# EAGLE design rev2-roadrunner (EAGLE 8.2.2)
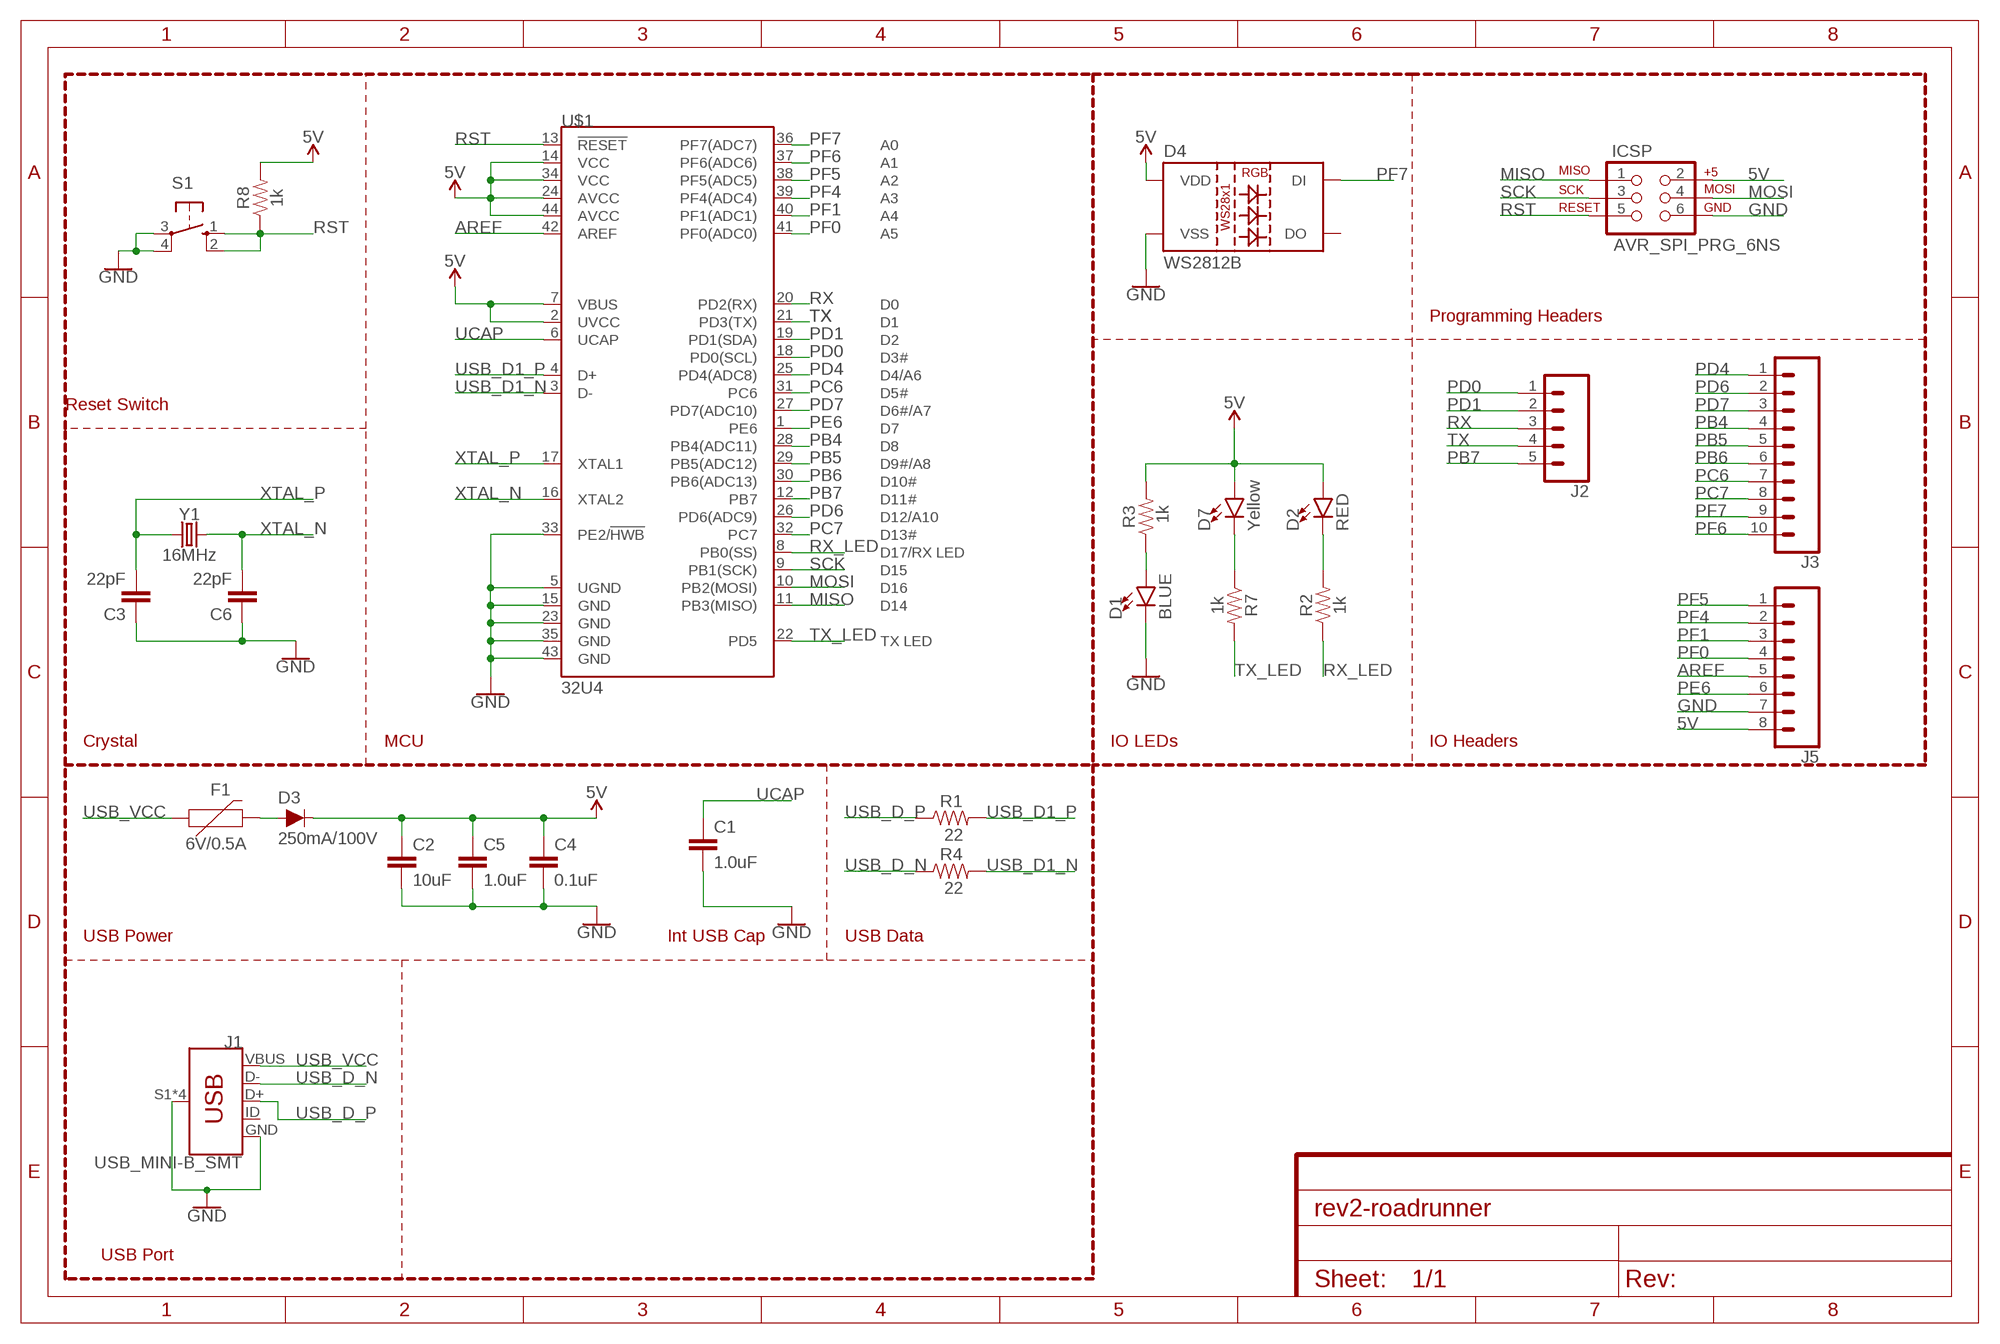
[diagram p0: schematic, sheet 1]

## Parts
C1  1.0uF  1.0UF-1206-50V-10%  [1206]
C2  10uF  10UF-1206-6.3V-20%  [1206]
C3  22pF  10UF-1206-6.3V-20%  [1206]
C4  0.1uF  1.0UF-1206-50V-10%  [1206]
C5  1.0uF  1.0UF-1206-50V-10%  [1206]
C6  22pF  10UF-1206-6.3V-20%  [1206]
D1  BLUE  LED-BLUE1206  [LED-1206]
D2  RED  LED-RED1206  [LED-1206]
D3  250mA/100V  DIODE-BAS16J  [SOD-323]
D4  WS2812B  [WS2812B]
D7  Yellow  LED-YELLOWLILYPAD  [LED-1206]
F1  6V/0.5A  PPTC_HALF-AMP  [1206]
ICSP  AVR_SPI_PRG_6NS  [2X3-NS]
J1  USB_MINI-B_SMT  [USB-MINIB]
J2  CONN_05  [1X05]
J3  CONN_10"  [1X10]
J5  CONN_08"  [1X08]
R1  22  RESISTOR1206  [1206]
R2  1k  RESISTOR1206  [1206]
R3  1k  RESISTOR1206  [1206]
R4  22  RESISTOR1206  [1206]
R7  1k  RESISTOR1206  [1206]
R8  1k  RESISTOR1206  [1206]
S1  10-XX  [B3F-10XX]
U$1  32U4  ATMEGA32U4TQFP-44  [TQFP44]
Y1  16MHz  CRYSTAL-16MHZPTH-HC49US  [HC49US]

## Nets
5V [VCC]: C2.1 C4.1 C5.1 D2.A D3.C D4.1(VDD) D7.A ICSP.2 J5.8 R3.2 R8.2 U$1.2(UVCC) U$1.7(VBUS) U$1.14(VCC) U$1.24(AVCC) U$1.34(VCC) U$1.44(AVCC)
AREF: J5.5 U$1.42(AREF)
GND [GND]: C1.2 C2.2 C3.1 C4.2 C5.2 C6.1 D1.C D4.3(VSS) ICSP.6 J1.GND J1.S1(SHIELD) J1.S2(SHIELD) J1.S3(SHIELD) J1.S4(SHIELD) J5.7 S1.3(P) S1.4(P1) U$1.5(UGND) U$1.15(GND) U$1.23(GND) U$1.33(PE2/!HWB) U$1.35(GND) U$1.43(GND)
MISO: ICSP.1 U$1.11(PB3(MISO))
MOSI: ICSP.4 U$1.10(PB2(MOSI))
N$1: D1.A R3.1
N$2: D7.C R7.1
N$3: D2.C R2.2
N$4: D3.A F1.2
PB4: J3.4 U$1.28(PB4(ADC11))
PB5: J3.5 U$1.29(PB5(ADC12))
PB6: J3.6 U$1.30(PB6(ADC13))
PB7: J2.5 U$1.12(PB7)
PC6: J3.7 U$1.31(PC6)
PC7: J3.8 U$1.32(PC7)
PD0: J2.1 U$1.18(PD0(SCL))
PD1: J2.2 U$1.19(PD1(SDA))
PD4: J3.1 U$1.25(PD4(ADC8))
PD6: J3.2 U$1.26(PD6(ADC9))
PD7: J3.3 U$1.27(PD7(ADC10))
PE6: J5.6 U$1.1(PE6)
PF0: J5.4 U$1.41(PF0(ADC0))
PF1: J5.3 U$1.40(PF1(ADC1))
PF4: J5.2 U$1.39(PF4(ADC4))
PF5: J5.1 U$1.38(PF5(ADC5))
PF6: J3.10 U$1.37(PF6(ADC6))
PF7: D4.4(DI) J3.9 U$1.36(PF7(ADC7))
RST: ICSP.5 R8.1 S1.1(S) S1.2(S1) U$1.13(!RESET)
RX: J2.3 U$1.20(PD2(RX))
RX_LED: R2.1 U$1.8(PB0(SS))
SCK: ICSP.3 U$1.9(PB1(SCK))
TX: J2.4 U$1.21(PD3(TX))
TX_LED: R7.2 U$1.22(PD5)
UCAP: C1.1 U$1.6(UCAP)
USB_D1_N: R4.2 U$1.3(D-)
USB_D1_P: R1.2 U$1.4(D+)
USB_D_N: J1.D- R4.1
USB_D_P: J1.D+ R1.1
USB_VCC [VCC]: F1.1 J1.VBUS
XTAL_N: C6.2 U$1.16(XTAL2) Y1.2
XTAL_P: C3.2 U$1.17(XTAL1) Y1.1
Unconnected: D4.2(DO) J1.ID

## Notes on the sheet
- Programming Headers
- Reset Switch
- Crystal | MCU | IO LEDs | IO Headers
- USB Power | Int USB Cap | USB Data
- USB Port

## Library data of the parts
C1 C5 = SparkFun-Capacitors:1.0UF: 1µF ceramic capacitors A capacitor is a passive two-terminal electrical component used to store electrical energy temporarily in an electric field.; PROD_ID: CAP-09822
C2 = SparkFun-Capacitors:10UF: 10.0µF ceramic capacitors A capacitor is a passive two-terminal electrical component used to store electrical energy temporarily in an electric field.; PROD_ID: CAP-10057
C3 C6 = SparkFun-Capacitors:10UF: 10.0µF ceramic capacitors A capacitor is a passive two-terminal electrical component used to store electrical energy temporarily in an electric field.; PROD_ID: CAP-10057; VALUE: 10uF
C4 = SparkFun-Capacitors:1.0UF: 1µF ceramic capacitors A capacitor is a passive two-terminal electrical component used to store electrical energy temporarily in an electric field.; PROD_ID: CAP-09822; VALUE: 1.0uF
D1 = SparkFun-LED:LED-BLUE: Blue SMD LED Used in manufacturing of various products at SparkFun Packages: 0603 - SMD 0603 package [Product Link] <http://www.digikey.com/product-detail/en/SMLE12BC7TT86/511-1589-2-ND/1641808> 1206 - SMD1206 package [Product Link] <http://www.digikey.com/product-detail/en/lite-on-inc/LTST-C150TBKT/160-1643-1-ND/573584> SparkFun Products: ESP8266 Thing-Dev Board <https://www.sparkfun.com/products/13711> RedBoard <https://www.sparkfun.com/products/12757>; PROD_ID: DIO-09911
D2 = SparkFun-LED:LED-RED: Red SMD LED Used in manufacturing of most products at SparkFun Packages: 0603 - SMD 0603 package [Product Link] <http://docs.avagotech.com/docs/AV02-0551EN> 0603 SMART - SMD 0603 SMART package ( more efficient and expensive)[Product Link] <http://www.osram-os.com/Graphics/XPic2/00077099_0.pdf> 1206 - SMD1206 package [Product Link] <https://www.sparkfun.com/datasheets/DevTools/LilyPad/Q150OVS4.pdff> SparkFun Products: Pro Mini 328 -5V <https://www.sparkfun.com/products/821> RedBoard <https://www.sparkfun.com/products/12757> IOIO-OTG <https://www.sparkfun.com/products/13613>; PROD_ID: DIO-09912
D3 = SparkFun-DiscreteSemi:DIODE: Diode These are standard reverse protection diodes and small signal diodes. SparkFun Products: SparkFun SparkPunk Sound Kit <https://www.sparkfun.com/products/11177> SparkFun ESP8266 Thing <https://www.sparkfun.com/products/13231>; PROD_ID: DIO-09646
D4 = SparkFun-LED:WS2812B: WS2812B SMD addressable RGB LED 5x5mm SMD LED with built-in controller IC. Color: Red/Green/Blue mC Rating: RGB: 390, 660, 180 mcd Forward Voltage: RGB: 2.0, 3.0, 3.0 V Packages:WS2812B SparkFun Products: Blynk Board - ESP8266 <https://www.sparkfun.com/products/13794>; PROD_ID: DIO-12503
D7 = SparkFun-LED:LED-YELLOW: Yellow SMD LED Used in manufacturing several products at SparkFun. Packages: 0603 - SMD 0603 package[Product Link] <http://www.kingbrightusa.com/product.asp?catalog_name=LED&product_id=APT1608SYCK> 0603 -SMART - SMART SMD 0603 package (more efficient/more expensive) [Product Link] <http://www.osram-os.com/osram_os/en/products/product-catalog/led-light-emitting-diodes/smartled-0603/ly-l29k/index.jsp> LilyPad - SMD1206 package[Product Datasheet] <https://www.sparkfun.com/datasheets/DevTools/LilyPad/Q150YUS4.pdf> SparkFun Products: Blynk Board <https://www.sparkfun.com/products/13794> IOIO-OTG <https://www.sparkfun.com/products/13613> XBee Explorer Serial <https://www.sparkfun.com/products/13225>; PROD_ID: DIO-09909
F1 = SparkFun-Fuses:PPTC: Resettable Fuse PPTC Resettable Fuse. Really a sort of resistor with a polymeric positive temperature coefficient whose resistance increases dramatically with an increase in temperature. When heated by the power passing through the resistance rises causing the current to be limited, protecting the circuit. This is achieved by the transition of the polymer from a crystalline to an amorphous state where the conductive carbon separates breaking the conductive pathways found in the cool crystalline structure. When a PPTC cools back down it resumes conducting letting the circuit turn back on. SparkFun Products: SparkFun RedBoard - Programmed with Arduino <https://www.sparkfun.com/products/12757> Pro Micro - 5V/16MHz <https://www.sparkfun.com/products/12640> Arduino Pro 328 - 5V/16MHz <https://www.sparkfun.com/products/10915> MP3 Trigger <https://www.sparkfun.com/products/13720>; PROD_ID: RES-08585
ICSP = SparkFun-Connectors:AVR_SPI_PRG_6: AVR ISP 6 Pin This is the reduced ISP connector for AVR programming. Common on Arduino. This footprint will take up less PCB space and can be used with a 10-pin to 6-pin adapter such as SKU: BOB-08508 **Special note about "TEST_POINT" package. The stop mask is on the top side, so if you want your programming test points to be on the bottom of your board, make sure to place this package on the bottom side of the board. This also ensure that the orientation to program from the bottom side will be correct.
J1 = SparkFun-Connectors:USB_MINI-B: USB type Mini-B Connector Breaks out 5th pin, and includes shield pins if needed. SparkFun Products: SparkFun FTDI Basic Breakout <https://www.sparkfun.com/products/9716> SparkFun XBee Explorer USB <https://www.sparkfun.com/products/11812> SparkFun Redboard <https://www.sparkfun.com/products/12757>; PROD_ID: CONN-08193; SF_ID: PRT-00587
J2 = SparkFun-Connectors:CONN_05: Multi connection point. Often used as Generic Header-pin footprint for 0.1 inch spaced/style header connections On any of the 0.1 inch spaced packages, you can populate with these: Break Away Headers - Straight <https://www.sparkfun.com/products/116> (PRT-00116) Break Away Male Headers - Right Angle <https://www.sparkfun.com/products/553> (PRT-00553) Female Headers <https://www.sparkfun.com/products/115> (PRT-00115) Break Away Headers - Machine Pin <https://www.sparkfun.com/products/117> (PRT-00117) Break Away Female Headers - Swiss Machine Pin <https://www.sparkfun.com/products/743> (PRT-00743) For SCREWTERMINALS and SPRING TERMINALS visit here: Screw Terimnals on SparkFun.com <https://www.sparkfun.com/search/results?term=Screw+Terminals> (5mm/3.5mm/2.54mm spacing) This device is also useful as a general connection point to wire up your design to another part of your project. Our various solder wires solder well into these plated through hole pads. Hook-Up Wire - Assortment (Stranded, 22 AWG) <https://www.sparkfun.com/products/11375> (PRT-11375) Hook-Up Wire - Assortment (Solid Core, 22 AWG) <https://www.sparkfun.com/products/11367> (PRT-11367) View the entire wire category on our website here <https://www.sparkfun.com/categories/141> Special notes: Molex polarized connector foot print use with SKU : PRT-08231 with associated crimp pins and housings. 1MM SMD Version SKU: PRT-10208
J3 = SparkFun-Connectors:CONN_10: Multi connection point. Often used as Generic Header-pin footprint for 0.1 inch spaced/style header connections On any of the 0.1 inch spaced packages, you can populate with these: Break Away Headers - Straight <https://www.sparkfun.com/products/116> (PRT-00116) Break Away Male Headers - Right Angle <https://www.sparkfun.com/products/553> (PRT-00553) Female Headers <https://www.sparkfun.com/products/115> (PRT-00115) Break Away Headers - Machine Pin <https://www.sparkfun.com/products/117> (PRT-00117) Break Away Female Headers - Swiss Machine Pin <https://www.sparkfun.com/products/743> (PRT-00743) Arduino Stackable Header - 10 Pin <https://www.sparkfun.com/products/11376> (PRT-11376) For SCREWTERMINALS and SPRING TERMINALS visit here: Screw Terimnals on SparkFun.com <https://www.sparkfun.com/search/results?term=Screw+Terminals> (5mm/3.5mm/2.54mm spacing) This device is also useful as a general connection point to wire up your design to another part of your project. Our various solder wires solder well into these plated through hole pads. Hook-Up Wire - Assortment (Stranded, 22 AWG) <https://www.sparkfun.com/products/11375> (PRT-11375) Hook-Up Wire - Assortment (Solid Core, 22 AWG) <https://www.sparkfun.com/products/11367> (PRT-11367) View the entire wire category on our website here <https://www.sparkfun.com/categories/141> Special notes: Molex polarized connector foot print use with SKU : PRT-08231 with associated crimp pins and housings. 1MM SMD Version SKU: PRT-10208 NOTES ON THE VARIANTS LOCK and LOCK_LONGPADS... This footprint was designed to help hold the alignment of a through-hole component (i.e. 6-pin header) while soldering it into place. You may notice that each hole has been shifted either up or down by 0.005 of an inch from it's more standard position (which is a perfectly straight line). This slight alteration caused the pins (the squares in the middle) to touch the edges of the holes. Because they are alternating, it causes a "brace" to hold the component in place. 0.005 has proven to be the perfect amount of "off-center" position when using our standard breakaway headers. Although looks a little odd when you look at the bare footprint, once you have a header in there, the alteration is very hard to notice. Also,if you push a header all the way into place, it is covered up entirely on the bottom side.; PROD_ID: CONN-11563
J5 = SparkFun-Connectors:CONN_08: Multi connection point. Often used as Generic Header-pin footprint for 0.1 inch spaced/style header connections On any of the 0.1 inch spaced packages, you can populate with these: Break Away Headers - Straight <https://www.sparkfun.com/products/116> (PRT-00116) Break Away Male Headers - Right Angle <https://www.sparkfun.com/products/553> (PRT-00553) Female Headers <https://www.sparkfun.com/products/115> (PRT-00115) Break Away Headers - Machine Pin <https://www.sparkfun.com/products/117> (PRT-00117) Break Away Female Headers - Swiss Machine Pin <https://www.sparkfun.com/products/743> (PRT-00743) Arduino Stackable Header - 8 Pin <https://www.sparkfun.com/products/9279> (PRT-09279) For SCREWTERMINALS and SPRING TERMINALS visit here: Screw Terimnals on SparkFun.com <https://www.sparkfun.com/search/results?term=Screw+Terminals> (5mm/3.5mm/2.54mm spacing) This device is also useful as a general connection point to wire up your design to another part of your project. Our various solder wires solder well into these plated through hole pads. Hook-Up Wire - Assortment (Stranded, 22 AWG) <https://www.sparkfun.com/products/11375> (PRT-11375) Hook-Up Wire - Assortment (Solid Core, 22 AWG) <https://www.sparkfun.com/products/11367> (PRT-11367) View the entire wire category on our website here <https://www.sparkfun.com/categories/141> Special notes: Molex polarized connector foot print use with SKU : PRT-08231 with associated crimp pins and housings. 1MM SMD Version SKU: PRT-10208 NOTES ON THE VARIANTS LOCK and LOCK_LONGPADS... This footprint was designed to help hold the alignment of a through-hole component (i.e. 6-pin header) while soldering it into place. You may notice that each hole has been shifted either up or down by 0.005 of an inch from it's more standard position (which is a perfectly straight line). This slight alteration caused the pins (the squares in the middle) to touch the edges of the holes. Because they are alternating, it causes a "brace" to hold the component in place. 0.005 has proven to be the perfect amount of "off-center" position when using our standard breakaway headers. Although looks a little odd when you look at the bare footprint, once you have a header in there, the alteration is very hard to notice. Also,if you push a header all the way into place, it is covered up entirely on the bottom side.; PROD_ID: CONN-08438
R1-R4 R7 R8 = SparkFun-Resistors:RESISTOR: Generic Resistor Package
S1 = switch-omron:10-XX: OMRON SWITCH; MPN: B3F-1000; OC_FARNELL: 176432; OC_NEWARK: 36M3542
U$1 = SparkFun-IC-Microcontroller:ATMEGA32U4: Atmel MCU, 32KByte Atmel 44-pin 8-bit Microcontroller with 32KBytes of ISP Flash and USB Controller Datasheet <http://cdn.sparkfun.com/datasheets/Dev/Arduino/Boards/ATMega32U4.pdf> SparkFun Products LilyPad Arduino USB - ATmega32U4 Board <https://www.sparkfun.com/products/12049> (DEV-12049) Pro Micro - 5V/16MHz <https://www.sparkfun.com/products/12640> (DEV-12640) Pro Micro - 3.3V/8MHz <https://www.sparkfun.com/products/12587> (DEV-12587) Fio v3 - ATmega32U4 <https://www.sparkfun.com/products/11520> (DEV-11520) Qduino Mini <https://www.sparkfun.com/products/13614> (DEV-13614) Makey Makey - Standard Kit <https://www.sparkfun.com/products/11511> (WIG-11511) Makey Makey Deluxe Kit <https://www.sparkfun.com/products/11519> (WIG-11519); PROD_ID: IC-11161
Y1 = SparkFun-Clocks:CRYSTAL-16MHZ: 16MHz Crystal Digikey Example <http://www.digikey.com/product-search/en?keywords=535-9122-1-ND> Frequency: 16MHz Frequency Stability: ±50ppm Frequency Tolerance: ±20ppm Load Capacitance: 18pF SparkFun Products: Pro Micro -5V/16MHz <https://www.sparkfun.com/products/12640> SparkFun Serial Enabled LCD Kit <https://www.sparkfun.com/products/10097>; PROD_ID: XTAL-08181; SF_ID: COM-00536

## Net classes
1 GND: width 0.254 mm
2 VBAT: width 0.254 mm
3 VCC: width 0.254 mm

## Board
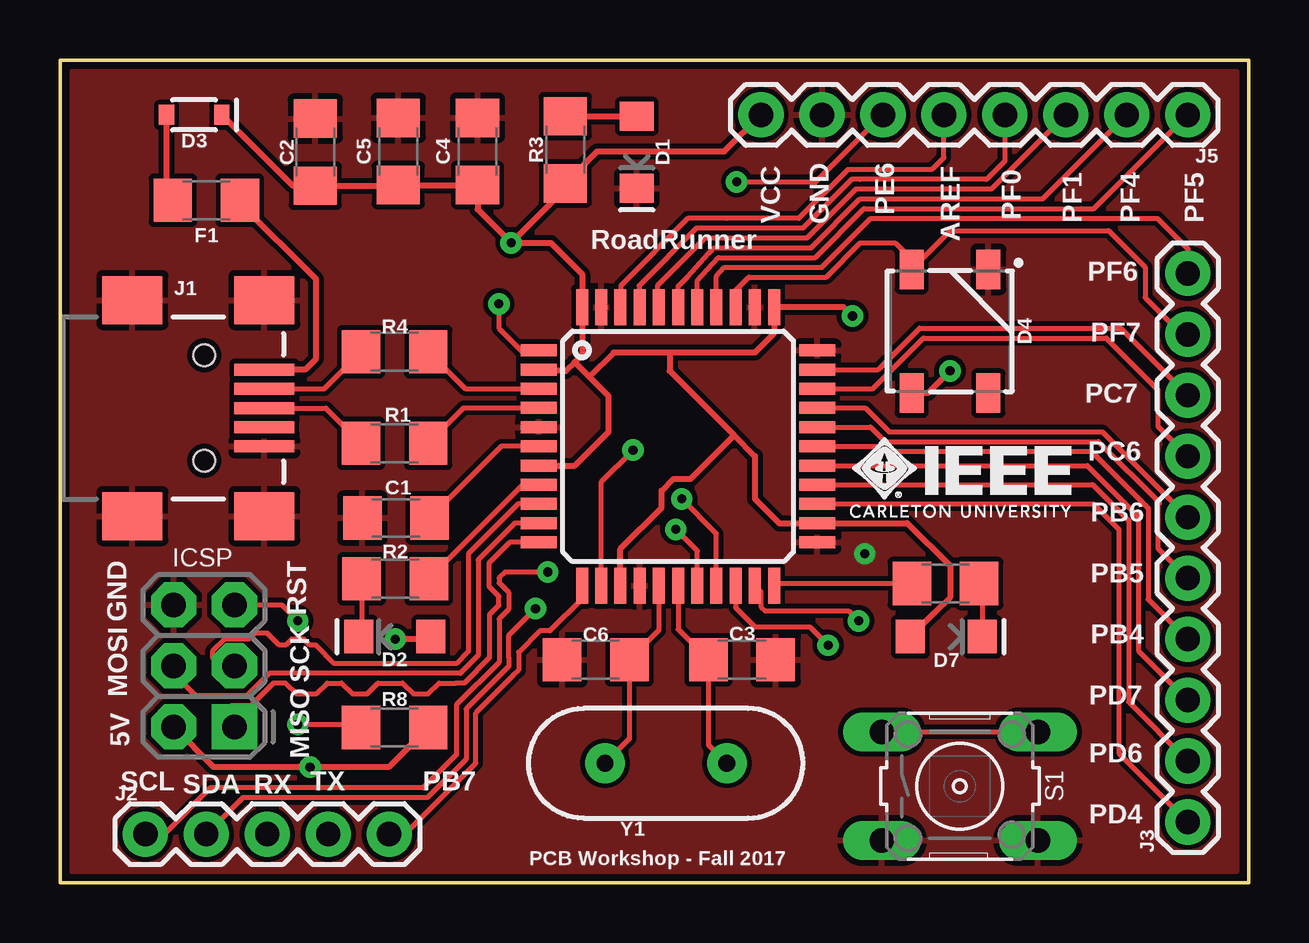
[diagram p1: board, top side]
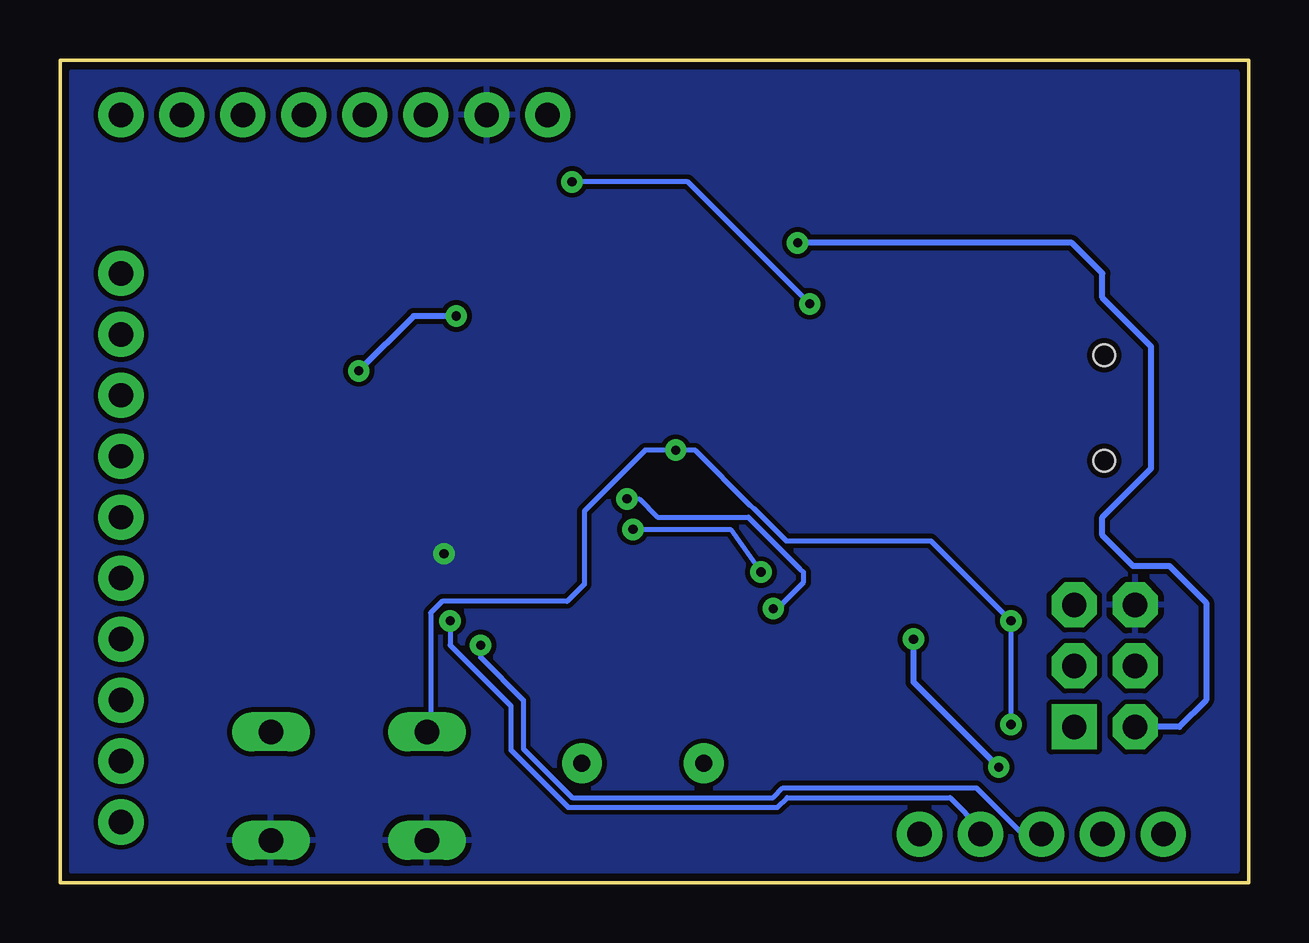
[diagram p2: board, bottom side, seen from below]

Size 49.53 x 34.29 mm. Coordinates in mm from the lower left corner, seen from the top.
Outline: 0,0 0,34.29 49.53,34.29 49.53,0 0,0
Copper layers (1*16): Top 0.035mm / dielectric 1.5mm / Bottom 0.035mm
Design rules "SparkFun *": minimum track width 8mil, minimum drill 15mil, track to track 8mil, track to pad 8mil, pad to pad 8mil, via to via 8mil, smd to smd 8mil, copper to edge 10mil, drill to drill 8mil, minimum pad ring 12mil, minimum via ring 10mil, stop-mask expansion 4mil, vias tented up to drill 25mil, thermal gap 10mil

### Footprints (pad centres in the part's own frame; a part is rotated, then mirrored left to right if it is on the bottom)
1206 = smd 1.6 x 1.8: 1 -1.4,0; 2 1.4,0
LED-1206 = smd 1.2 x 1.4: A -1.5,0; C 1.5,0
SOD-323 = smd 0.63 x 0.83: A 1.15,0; C -1.15,0
WS2812B = smd 1.651 x 1: 1 2.577,-1.6; 2 2.577,1.6; 3 -2.577,1.6; 4 -2.577,-1.6
2X3-NS = drill 1.016 pad 1.88 square: 1 -2.54,-1.27 | drill 1.016 pad 1.88 octagon: 2 -2.54,1.27; 3 0,-1.27; 4 0,1.27; 5 2.54,-1.27; 6 2.54,1.27
USB-MINIB = smd 2.5 x 0.5: D+ 2.5,0; D- 2.5,0.8; GND 2.5,-1.6; ID 2.5,-0.8; VBUS 2.5,1.6 | smd 2.5 x 2: S1 -3,4.5; S2 2.5,4.5; S3 -3,-4.5; S4 2.5,-4.5 | hole 0.9: 0,2.2; 0,-2.2
1X05 = drill 1.016 pad 1.88: 1 0,0; 2 2.54,0; 3 5.08,0; 4 7.62,0; 5 10.16,0
1X10 = drill 1.016 pad 1.88: 1 0,0; 2 2.54,0; 3 5.08,0; 4 7.62,0; 5 10.16,0; 6 12.7,0; 7 15.24,0; 8 17.78,0; 9 20.32,0; 10 22.86,0
1X08 = drill 1.016 pad 1.88: 1 0,0; 2 2.54,0; 3 5.08,0; 4 7.62,0; 5 10.16,0; 6 12.7,0; 7 15.24,0; 8 17.78,0
B3F-10XX = drill 1.016 long: 1 -3.251,2.261; 2 3.251,2.261; 3 -3.251,-2.261; 4 3.251,-2.261
TQFP44 = smd 1.5 x 0.5: 1 -5.8,4; 2 -5.8,3.2; 3 -5.8,2.4; 4 -5.8,1.6; 5 -5.8,0.8; 6 -5.8,0; 7 -5.8,-0.8; 8 -5.8,-1.6; 9 -5.8,-2.4; 10 -5.8,-3.2; 11 -5.8,-4; 23 5.8,-4; 24 5.8,-3.2; 25 5.8,-2.4; 26 5.8,-1.6; 27 5.8,-0.8; 28 5.8,0; 29 5.8,0.8; 30 5.8,1.6; 31 5.8,2.4; 32 5.8,3.2; 33 5.8,4 | smd 0.5 x 1.5: 12 -4,-5.8; 13 -3.2,-5.8; 14 -2.4,-5.8; 15 -1.6,-5.8; 16 -0.8,-5.8; 17 0,-5.8; 18 0.8,-5.8; 19 1.6,-5.8; 20 2.4,-5.8; 21 3.2,-5.8; 22 4,-5.8; 34 4,5.8; 35 3.2,5.8; 36 2.4,5.8; 37 1.6,5.8; 38 0.8,5.8; 39 0,5.8; 40 -0.8,5.8; 41 -1.6,5.8; 42 -2.4,5.8; 43 -3.2,5.8; 44 -4,5.8
HC49US = drill 0.7 pad 1.651: 1 -2.54,0; 2 2.54,0

### Placement (x,y rotation side)
C1  14,15.21 180 top
C2  10.64,30.45 90 top
C3  28.42,9.3 180 top
C4  17.4,30.48 90 top
C5  14.1,30.48 90 top
C6  22.32,9.3 0 top
D1  24.03,30.45 270 top
D2  13.94,10.26 180 top
D3  5.59,32 180 top
D4  37.08,22.99 270 top
D7  36.93,10.26 0 top
F1  6.1,28.45 180 top
ICSP  6,9.04 90 top
J1  6.01,19.79 0 top
J2  3.56,2.03 0 top
J3  46.99,2.54 90 top
J5  46.99,32 180 top
R1  13.94,18.32 0 top
R2  13.97,12.67 180 top
R3  21.05,30.55 270 top
R4  13.94,22.13 0 top
R7  36.9,12.48 180 top
R8  13.94,6.48 0 top
S1  37.49,4.03 0 top
U$1  25.75,18.19 0 top
U$2  [IEEECARLETON-ROADRUNNER]  32.87,15.14 0 top
Y1  25.25,4.99 180 top

### Tracks (layer width: path | path; a pad name or v marks a point on that pad's centre or on a via)
5V  (via drill 0.38)
  Top 0.254: D3.C 9.69,29.05 C2.1 14.07,29.05 | 21.45,21.7 21.75,22.01 U$1.44 21.75,25.37 20.46,26.67 v18.8,26.67 | 21.45,21.7 21.08,21.34 20.01,21.34 U$1.2 | U$1.7 21.46,17.39 22.86,18.8 22.86,20.29 22.06,21.09 | 22.06,21.09 21.45,21.7 | 22.06,21.09 23.06,22.1 25.4,22.1 | v33.02,23.62 32.65,23.99 U$1.34 29.75,22.89 28.96,22.1 25.4,22.1 | v37.08,21.34 36.16,20.41 D4.1 | 20.98,29.08 R3.2 | J5.8 27.69,30.48 22.38,30.48 R3.2 | 25.4,22.1 25.4,21.34 28.09,18.65 | 28.09,18.65 28.96,17.78 28.96,16 29.97,14.99 U$1.24 35.3,14.99 37.08,13.21 37.08,11.9 36.43,11.25 36.42,11.25 D7.A | U$1.14 23.35,13.92 25.07,15.63 25.07,16.35 25.56,16.84 26.28,16.84 28.09,18.65 | D2.A 15.34,10.16 v13.97,10.16 | R8.2 13.69,4.83 v10.41,4.83 6.41,4.83 ICSP.2 | v18.8,26.67 21.05,28.92 R3.2 | v18.8,26.67 17.4,28.07 C4.1 C5.1
  Top 0.406: 14.07,29.05 C5.1
  Bottom 0.254: v33.02,23.62 34.8,23.62 v37.08,21.34 | v18.8,26.67 7.37,26.67 6.1,25.4 6.1,24.38 4.06,22.35 4.06,17.27 6.1,15.24 6.1,14.48 4.83,13.21 3.3,13.21 1.78,11.68 1.78,7.62 2.89,6.5 ICSP.2 | v13.97,10.16 13.97,8.38 v10.41,4.83
AREF
  Top 0.203: J5.5 36.83,30.23 36.32,29.72 33.49,29.72 | 33.49,29.72 | 33.49,29.72 32.82,29.72 30.79,27.69 27.77,27.69 | 27.77,27.69 | 27.77,27.69 26.16,27.69 23.37,24.89 23.37,24.01 U$1.42
GND  (via drill 0.38)
  other vias: 33.53,13.72
  pour Top: 0.51,33.78 0.51,0.51 49.02,0.51 49.02,33.78
  pour Bottom: 0.51,33.78 0.51,0.51 49.02,0.51 49.02,33.78
MISO
  Top 0.203: U$1.11 18.73,14.19 17.89,13.35 17.89,12.34 18.29,11.94 18.29,11.57 17.89,11.18 17.89,9.37 16.85,8.33 16.51,8.33 | 16.51,8.33 | 16.51,8.33 15.79,8.33 15.33,7.87 14.73,7.87 14.28,8.33 13.25,8.33 12.79,7.87 12.19,7.87 11.73,8.33 11.12,8.33 10.67,7.87 9.86,7.87 9.4,8.33 8.89,8.33 7.96,7.39 7.14,7.39 6.6,6.86 6.6,6.6 6.86,6.35 7.12,6.35 ICSP.1
MOSI
  Top 0.203: U$1.10 18.96,14.99 17.42,13.46 17.42,9.48 16.68,8.74 8.72,8.74 7.79,7.8 5.66,7.8 5.08,8.38 5.08,8.7 ICSP.4
N$1
  Top 0.254: R3.1 D1.A | D1.A
N$2
  Top 0.203: R7.1 38.43,12.35 D7.C
N$3
  Top 0.203: R2.2 12.57,10.39 D2.C
N$4
  Top 0.254: 4.44,28.71 D3.A
  Top 0.406: F1.2 4.44,28.71
PB4
  Top 0.203: U$1.28 34,18.19 34.21,17.98 42.98,17.98 45.34,15.62 45.34,11.81 J3.4
PB5
  Top 0.203: U$1.29 33.77,18.99 34.38,18.39 43.27,18.39 45.82,15.83 45.74,15.76 45.74,13.95 J3.5
PB6
  Top 0.203: U$1.30 33.55,19.79 34.54,18.8 43.43,18.8 J3.6
PB7
  Top 0.203: U$1.12 21.75,11.85 20.41,10.51 20,10.51 19.11,9.62 19.11,8.87 18.87,8.63 | 18.87,8.63 | 18.87,8.63 17.32,7.08 17.32,5 14.36,2.03 J2.5
PC6
  Top 0.203: U$1.31 33.87,20.59 35.97,22.7 43.59,22.7 45.74,20.55 45.74,19.02 J3.7
PC7
  Top 0.203: U$1.32 34.09,21.39 35.81,23.11 44.2,23.11 J3.8
PD0  (via drill 0.38)
  Top 0.203: U$1.18 26.55,13.83 v25.65,14.73 | v20.32,12.95 18.54,12.95 18.3,12.71 18.3,12.51 18.69,12.11 18.69,11.41 18.3,11.01 18.3,9.21 16.51,7.42 16.51,5.33 15.14,3.96 6.27,3.96 4.34,2.03 J2.1
  Bottom 0.203: v25.65,14.73 21.59,14.73 v20.32,12.95
PD1  (via drill 0.38)
  Top 0.203: U$1.19 27.35,14.56 v25.91,16 | 18.7,9.37 | 18.7,9.37 18.7,9.04 16.92,7.25 16.92,5.16 15.31,3.56 7.62,3.56 J2.2 | v19.81,11.43 18.7,10.32 18.7,9.37
  Bottom 0.203: v25.91,16 25.4,16 24.64,15.24 20.85,15.24 18.7,13.09 18.54,12.95 18.54,12.53 19.65,11.43 v19.81,11.43
PD4
  Top 0.203: U$1.25 43.06,15.79 44.12,14.73 44.12,5.41 J3.1
PD6
  Top 0.203: U$1.26 43.03,16.59 44.53,15.1 44.53,7.54 J3.2
PD7
  Top 0.203: U$1.27 42.8,17.39 44.93,15.27 44.93,9.68 J3.3
PE6  (via drill 0.38)
  Top 0.203: v18.29,24.13 18.29,23.11 19.3,22.1 19.86,22.1 U$1.1 | v28.19,29.21 31.5,29.21 J5.6
  Bottom 0.203: v18.29,24.13 23.37,29.21 v28.19,29.21
PF0
  Top 0.203: J5.4 39.37,30.07 38.61,29.31 33.33,29.31 | 33.33,29.31 | 33.33,29.31 32.99,29.31 32,28.32 | 32,28.32 | 32,28.32 30.96,27.28 27.6,27.28 | 27.6,27.28 | 27.6,27.28 26.52,27.28 24.13,24.89 24.13,24.02 U$1.41
PF1
  Top 0.203: J5.3 38.81,28.91 33.16,28.91 | 24.89,24.05 U$1.40 24.89,24.05 | 32.41,28.15 33.16,28.91 | 32.41,28.15 31.12,26.87 27.43,26.87 | 33.16,28.91 32.41,28.15 | 27.43,26.87 | 27.43,26.87 26.87,26.87 24.89,24.89 24.89,24.05
PF4
  Top 0.203: 25.65,24.09 U$1.39 25.75,24.86 26.03,25.13 | J5.2 40.95,28.5 33.33,28.5 31.29,26.47 27.26,26.47 27.26,26.46 27.24,26.46 27.14,26.34 27.02,26.23 26.15,25.26 26.03,25.13 | 26.03,25.13 26,25.1
PF5
  Top 0.203: U$1.38 26.55,25.09 27.43,26.06 31.46,26.06 33.49,28.09 42.55,28.09 | 42.55,28.09 | J5.1 43.08,28.09 42.55,28.09
PF6
  Top 0.203: U$1.37 27.35,25.29 27.69,25.65 31.75,25.65 33.78,27.69 42.72,27.69 | 42.72,27.69 | 42.72,27.69 45.72,27.69 46.99,26.42 J3.10
PF7
  Top 0.203: U$1.36 28.15,24.7 28.7,25.25 31.92,25.25 33.34,26.67 34.8,26.67 35.48,25.98 D4.4 37.1,27.18 43.69,27.18 45.21,25.65 45.21,24.38 46.74,22.86 J3.9
RST  (via drill 0.38)
  Top 0.203: ICSP.5 9.24,11.59 v9.91,10.92 | v9.91,6.6 12.42,6.6 R8.1 | S1.1 S1.2 | v23.88,18.03 22.55,16.71 U$1.13
  Bottom 0.203: v9.91,6.6 v9.91,10.92 13.24,14.26 19.27,14.26 20.62,15.61 20.78,15.75 23.07,18.03 v23.88,18.03 25.15,18.03 27.69,15.49 27.69,12.45 28.4,11.73 33.61,11.73 34.09,11.26 34.09,6.45 S1.1
RX  (via drill 0.38)
  Top 0.203: U$1.20 28.15,11.47 28.96,10.67 31.24,10.67 v32,9.91
  Bottom 0.203: v32,9.91 32,9.4 30.23,7.62 30.23,5.59 28.19,3.56 19.81,3.56 19.41,3.96 11.35,3.96 9.42,2.03 J2.3
RX_LED
  Top 0.203: R2.1 19.29,16.59 U$1.8
SCK
  Top 0.203: U$1.9 19.1,15.79 17.02,13.72 17.02,9.65 16.51,9.14 11.43,9.14 10.67,9.91 10.41,9.91 10.16,10.16 9.65,10.16 9.4,9.91 9.14,9.91 8.64,10.41 8.13,10.41 7.87,10.16 6.86,10.16 6.35,9.65 6.35,9.4 6.7,9.04 ICSP.3
TX  (via drill 0.38)
  Top 0.203: U$1.21 29.2,12.15 29.2,11.52 29.38,11.34 32.86,11.34 v33.27,10.92
  Bottom 0.203: v33.27,10.92 33.27,9.91 30.73,7.37 30.73,5.52 28.36,3.15 19.64,3.15 19.24,3.56 12.45,3.56 11.18,2.29 J2.4
TX_LED
  Top 0.203: U$1.22 29.84,12.48 R7.2
UCAP
  Top 0.203: U$1.6 18.38,18.19 C1.1
USB_D1_N
  Top 0.203: R4.2 16.88,20.59 U$1.3
USB_D1_P
  Top 0.203: R1.2 16.82,19.79 U$1.4
USB_D_N
  Top 0.203: J1.D- 11,20.59 R4.1
USB_D_P
  Top 0.203: J1.D+ 11.07,19.79 R1.1
USB_VCC
  Top 0.254: J1.VBUS 10.21,21.39 10.67,21.84 10.67,25.15 7.5,28.32
  Top 0.406: 7.5,28.32 F1.1
XTAL_N
  Top 0.203: U$1.16 24.95,10.53 C6.2 23.72,6 Y1.2
XTAL_P
  Top 0.203: U$1.17 25.75,10.57 C3.2 27.02,5.75 Y1.1

### Text on the board
tPlace: VCC | GND | AREF | PF0 | PF1 | PF4 | PF5 | PE6 | PF6 | PF7 | PC7 | PC6 | PB6 | PB5 | GND | RST | PB4 | MOSI | SCK | PD7 | 5V | SCL | SDA | RX | MISO | TX | PB7 | PD6 | PD4
tNames: RoadRunner | PCB Workshop - Fall 2017